# Altium project OneStep.PrjPCB
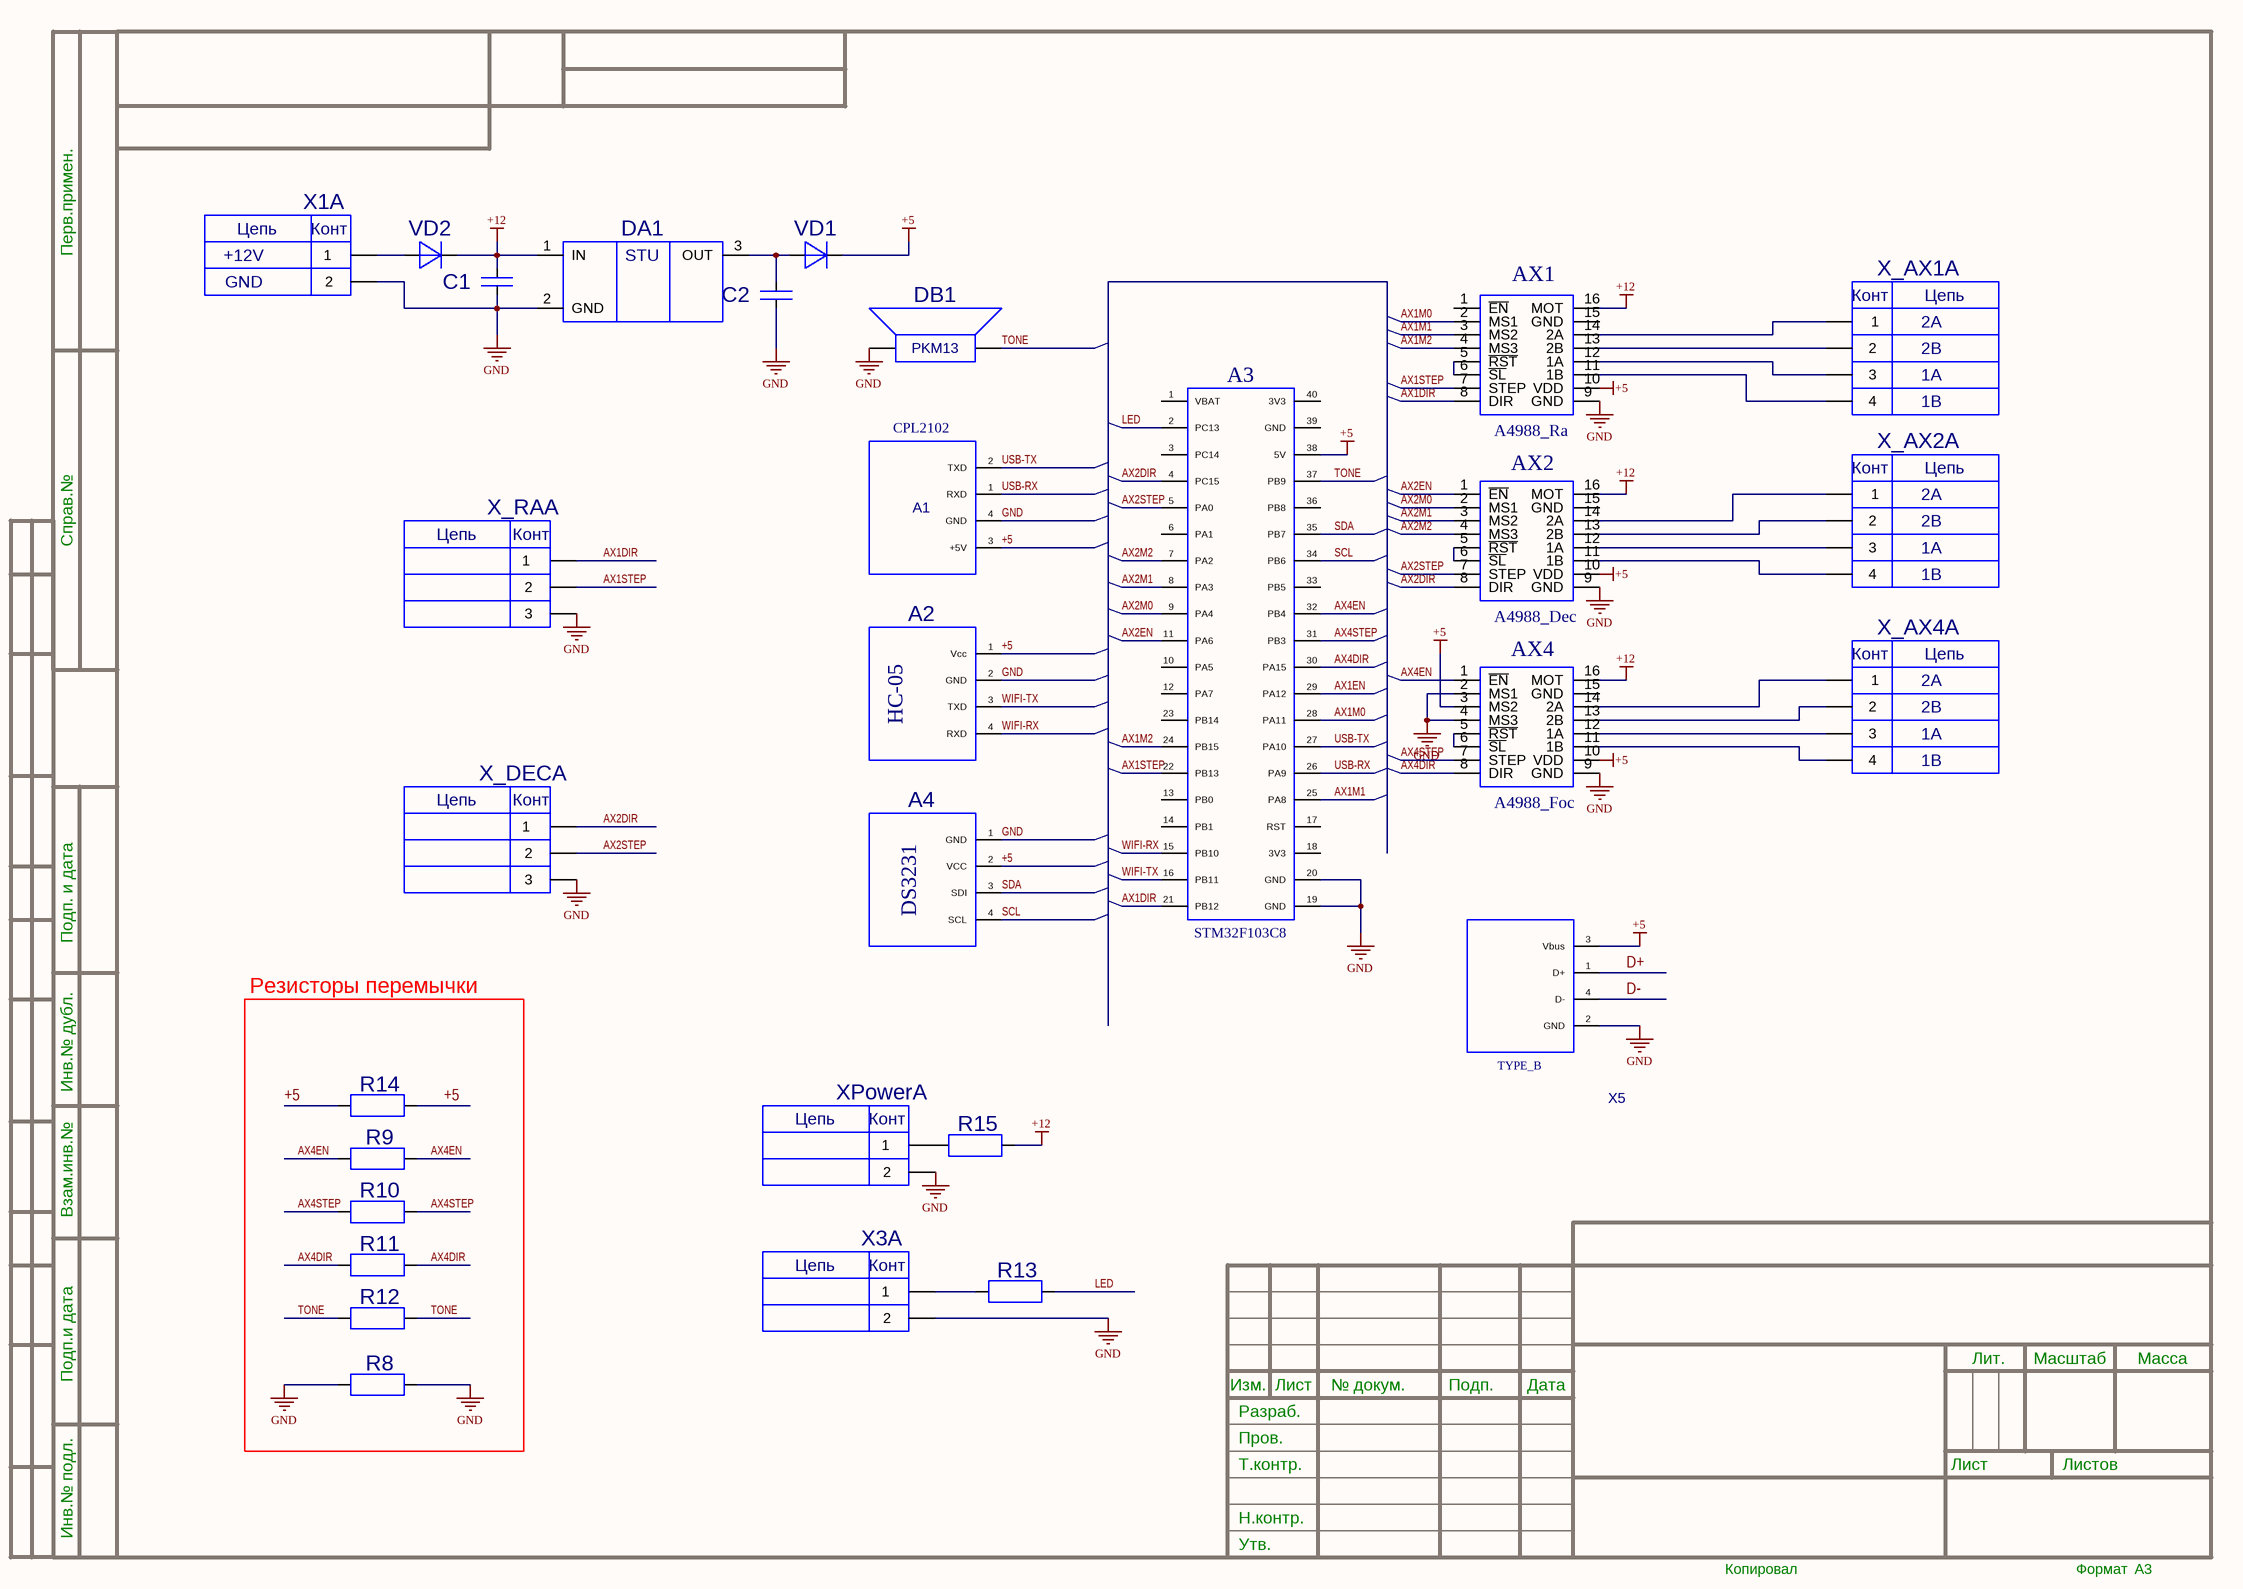
[diagram p0: OneStep.SchDoc]
Âèä_äîêóìåíòà: Ñõåìà ýëåêòðè÷åñêàÿ ïðèíöèïèàëüíàÿ; Êîä_äîêóìåíòà: Ý3; Наименование: 65656564364363635465/46546546546344623634; Обозначение: OneStep v3.16 Blue pill; Ðàçäåë: Äîêóìåíòàöèÿ; Ôèðìà: ÎÎÎ "Горизонт"; ï_Ðàçðàá: Ïåòðîâ
1 sheet, 30 parts. Net scope: global (net labels, ports and power ports of the same name join across sheets).
Board files: OneStep_È1.PcbDoc, OneStep_multy.PcbDoc

## Sheet OneStep.SchDoc
size 420 x 297 mm; Формат_листа: А3

### Parts
A1  CPL2102  [CP2102]
A2  HC-05  [HC-05]
A3  STM32F103C8  [STM32BLUE_PILL]
A4  DS3231  [DS3231]
AX1  A4988_Ra  [A4899]
AX2  A4988_Dec  [A4899]
AX4  A4988_Foc  [A4899]
C1  4,7мкФ  [C1206H19]  (value not drawn)
C2  4,7мкФ  [C1206H19]  (value not drawn)
DA1  L7805CD2T  [D2PAK]  (value not drawn)
DB1  PKM13  [PKM13]
R8  0 Ом  [R1206H07]  (value not drawn)
R9  0 Ом  [R1206H07]  (value not drawn)
R10  0 Ом  [R1206H07]  (value not drawn)
R11  0 Ом  [R1206H07]  (value not drawn)
R12  0 Ом  [R1206H07]  (value not drawn)
R13  0 Ом  [R1206H07]  (value not drawn)
R14  0 Ом  [R1206H07]  (value not drawn)
R15  24кОм  [R1206H07]  (value not drawn)
VD1  US1J  [SMA]  (value not drawn)
VD2  US1J  [SMA]  (value not drawn)
X1  PLS-02  [PLS-02]  (value not drawn)  (part A of 2)
X3  PLS-02  [PLS-02]  (value not drawn)  (part A of 2)
X5  TYPE_B  [Type_B]
X_AX1  PLS-04  [PLS-04]  (value not drawn)  (part A of 4)
X_AX2  PLS-04  [PLS-04]  (value not drawn)  (part A of 4)
X_AX4  PLS-04  [PLS-04]  (value not drawn)  (part A of 4)
X_DEC  DG128-5.0-03P  [DG128-5.0-03]  (value not drawn)  (part A of 3)
X_RA  DG128-5.0-03P  [DG128-5.0-03]  (value not drawn)  (part A of 3)
XPower  PLS-02  [PLS-02]  (value not drawn)  (part A of 2)

### Blocks framed on the sheet
Резисторы перемычки: R8-R12 R14

### Nets
+5: A1.3(+5V) A2.1(Vcc) A3.38(5V) A4.2(VCC) AX1.10(VDD) AX2.10(VDD) AX4.3(MS2) AX4.10(VDD) R14.1 R14.2 VD1.2(-) X5.3(Vbus)
+12: AX1.16(MOT) AX2.16(MOT) AX4.16(MOT) C1.2 DA1.1(IN) R15.2 VD2.2(-)
GND: A1.4(GND) A2.2(GND) A3.19(GND) A3.20(GND) A4.1(GND) AX1.9(GND) AX2.9(GND) AX4.2(MS1) AX4.4(MS3) AX4.9(GND) C1.1 C2.1 DA1.2(GND) DB1.1 R8.1 R8.2 X1.2 X3.2 X5.2(GND) X_DEC.3 X_RA.3 XPower.2
AX1DIR: A3.21(PB12) AX1.8(DIR) X_RA.1
AX1EN: A3.29(PA12)
AX1M0: A3.28(PA11) AX1.2(MS1)
AX1M1: A3.25(PA8) AX1.3(MS2)
AX1M2: A3.24(PB15) AX1.4(MS3)
AX1STEP: A3.22(PB13) AX1.7(STEP) X_RA.2
AX2DIR: A3.4(PC15) AX2.8(DIR) X_DEC.1
AX2EN: A3.11(PA6) AX2.1(~{EN})
AX2M0: A3.9(PA4) AX2.2(MS1)
AX2M1: A3.8(PA3) AX2.3(MS2)
AX2M2: A3.7(PA2) AX2.4(MS3)
AX2STEP: A3.5(PA0) AX2.7(STEP) X_DEC.2
AX4DIR: A3.30(PA15) AX4.8(DIR) R11.1 R11.2
AX4EN: A3.32(PB4) AX4.1(~{EN}) R9.1 R9.2
AX4STEP: A3.31(PB3) AX4.7(STEP) R10.1 R10.2
D+: X5.1(D+)
D-: X5.4(D-)
LED: A3.2(PC13) R13.2
SCL: A3.34(PB6) A4.4(SCL)
SDA: A3.35(PB7) A4.3(SDI)
TONE: A3.37(PB9) DB1.2 R12.1 R12.2
USB-RX: A1.1(RXD) A3.26(PA9)
USB-TX: A1.2(TXD) A3.27(PA10)
WIFI-RX: A2.4(RXD) A3.15(PB10)
WIFI-TX: A2.3(TXD) A3.16(PB11)
NetAX1_5: AX1.5(~{RST}) AX1.6(~{SL})
NetAX1_11: AX1.11(1B) X_AX1.4
NetAX1_12: AX1.12(1A) X_AX1.3
NetAX1_13: AX1.13(2B) X_AX1.2
NetAX1_14: AX1.14(2A) X_AX1.1
NetAX2_5: AX2.5(~{RST}) AX2.6(~{SL})
NetAX2_11: AX2.11(1B) X_AX2.4
NetAX2_12: AX2.12(1A) X_AX2.3
NetAX2_13: AX2.13(2B) X_AX2.2
NetAX2_14: AX2.14(2A) X_AX2.1
NetAX4_5: AX4.5(~{RST}) AX4.6(~{SL})
NetAX4_11: AX4.11(1B) X_AX4.4
NetAX4_12: AX4.12(1A) X_AX4.3
NetAX4_13: AX4.13(2B) X_AX4.2
NetAX4_14: AX4.14(2A) X_AX4.1
NetC2_2: C2.2 DA1.3(OUT) VD1.1(+)
NetR13_1: R13.1 X3.1
NetR15_1: R15.1 XPower.1
NetVD2_1: VD2.1(+) X1.1

Not connected (* = marked no-connect by the designer): A3 1(VBAT) 3(PC14) 6(PA1) 10(PA5) 12(PA7) 13(PB0) 14(PB1) 17(RST) 18(3V3) 23(PB14) 33(PB5) 36(PB8) 39(GND) 40(3V3); AX1 1(~{EN}) 15(GND); AX2 15(GND); AX4 15(GND)

### Notes on the sheet
- +12V
- GND
- 2A
- 2B
- 1A
- 1B
- Перв.примен.
- Справ.№
- Подп. и дата
- Инв.№ дубл.
- Взам.инв.№
- Подп.и дата
- Разраб.
- Изм.
- Лист
- № докум.
- Подп.
- Дата
- Лит.
- Масштаб
- Масса
- Т.контр.
- Пров.
- Листов
- Инв.№ подл.
- Утв.
- Н.контр.
- Копировал
- Формат
- (in symbol DG128-5.0-03P-14, part A) Цепь; Конт
- (in symbol PLS-02, part A) Цепь; Конт
- (in symbol PLS-04, part A) Конт; Цепь

### Library data of the parts
A1 = CPL2102: Manufacturer: Texas Instruments; ValueBOM: Микросхема CPL2102 Texas Instruments; DType: Микросхема; ComponentLink1Description: Datasheet; ComponentLink1URL: c:\Dataseets\Микросхемы\По фирмам\Avago Technologies\HCPL-4100.pdf; Package: SOT23-6; ValueSch: CPL2102
A2 = HC-05: Manufacturer: Texas Instruments; ValueBOM: Микросхема HC-05 Texas Instruments; DType: Микросхема; ComponentLink1Description: Datasheet; ComponentLink1URL: c:\Dataseets\Микросхемы\По фирмам\Avago Technologies\HCPL-4100.pdf; Package: SOT23-6; ValueSch: HC-05
A3 = STM32BLUE_PILL: Manufacturer: NXP; DType: Микросхема; ValueBOM: Микросхема STM32F103C8 NXP; ValueSch: STM32F103C8; ComponentLink1Description: Datasheet; ComponentLink1URL: c:\Dataseets\Микросхемы\По фирмам\Avago Technologies\HCPL-4100.pdf; Package: TSSOP8
A4 = DS3231: Manufacturer: Texas Instruments; ValueBOM: Микросхема DS3231 Texas Instruments; DType: Микросхема; ComponentLink1Description: Datasheet; ComponentLink1URL: c:\Dataseets\Микросхемы\По фирмам\Avago Technologies\HCPL-4100.pdf; Package: SOT23-6; ValueSch: DS3231
AX1 AX2 AX4 = DRV8825: STEP Motor Driver; TemperatureOperating: -40°C to +85°C; Поставщик: Texas; FullName: Микросхема MAX1316ECM Maxim; ID: DRV8825; ComponentLink1Description: Ссылка на сайт производителя; ComponentLink2Description: Ссылка на сайт производителя; ComponentLink3Description: Ссылка на сайт производителя; HelpURL: D:\Local_view\PDM\Справочники\Перечень ЭРИ\Документация\max1316-max1326.pdf; Mounting: SMT; PackageType: PLS; Part Number: DRV8825; TemperatureStorage: -40°C to +85°C; Type: Микросхема
C1 C2 = C1206 X7R 50V 4.7uF: Керамический ЧИП конденсатор; Part Number: 1206 X7R 50В 4,7мкФ; TemperatureOperating_max: 125; TemperatureOperating_min: -55; TKE: X7R; Tolerance: ±10%; Value: 4.7uF; Voltage: 50V; FullName: Конденсатор 1206 X7R 50В 4,7мкФ; ID: C1206 X7R 50V 4.7uF; ComponentLink1Description: Ссылка на сайт производителя; ComponentLink2Description: Ссылка на сайт производителя; ComponentLink3Description: Ссылка на сайт производителя; HelpURL: D:\local_view\PDM\Справочники\Перечень ЭРИ\Документация\Конденсаторы\Керамические\ЧИП\0201-1812_TY.pdf; Mounting: SMT; Package: 1206; PackageType: CAP-CHIP; Type: Конденсатор
DA1 = L7805CD2T: Positive voltage regulator; Manufacturer: ST Microelectronics; ExtendedParameters: DC Input voltage 35V / Output voltage 5+-2V / Output current to 1.5A / Dropout voltage 2-2.5V / Output noise voltage 40 µV/VO; Functionality: Линейные стабилизаторы напряжения; TemperatureOperating_max: +150; TemperatureOperating_min: -65; FullName: Микросхема L7805CD2T ST Microelectronics; ID: L7805CD2T; ComponentLink1Description: Ссылка на сайт производителя; ComponentLink2Description: Ссылка на сайт производителя; ComponentLink3Description: Ссылка на сайт производителя; HelpURL: D:\local_view\PDM\Справочники\Перечень ЭРИ\Документация\Микросхемы\Линейные стабилизаторы напряжения\L7800_STMicroelectronics.pdf; Mounting: SMT; Package: D2PAK; PackageType: DPAK; Part Number: L7805CD2T; Type: Микросхема
DB1 = PKM13: =Description
R8-R14 = R1206 0Ohm_5: Постоянный ЧИП резистор; Part Number: 1206 0 Ом±5%; Power: 0.25W; TemperatureOperating_max: 155; TemperatureOperating_min: -55; Tolerance: ±5%; Value: 0Оhm; FullName: Резистор 1206 0 Ом±5%; ID: R1206 0Ohm_5; ComponentLink1Description: Ссылка на сайт производителя; ComponentLink2Description: Ссылка на сайт производителя; ComponentLink3Description: Ссылка на сайт производителя; HelpURL: D:\Local_view\PDM\Справочники\Перечень ЭРИ\Документация\Резисторы\Постоянные\ЧИП\RC1206_yageo.pdf; Mounting: SMT; Package: 1206; PackageType: RES-CHIP; Type: Резистор
R15 = R1206 24kOhm_5: Постоянный ЧИП резистор; Part Number: 1206 24кОм±5%; Power: 0.25W; TemperatureOperating_max: 155; TemperatureOperating_min: -55; Tolerance: ±5%; Value: 24кОhm; FullName: Резистор 1206 24кОм±5%; ID: R1206 24kOhm_5; ComponentLink1Description: Ссылка на сайт производителя; ComponentLink2Description: Ссылка на сайт производителя; ComponentLink3Description: Ссылка на сайт производителя; HelpURL: D:\Local_view\PDM\Справочники\Перечень ЭРИ\Документация\Резисторы\Постоянные\ЧИП\RC1206_yageo.pdf; Mounting: SMT; Package: 1206; PackageType: RES-CHIP; Type: Резистор
VD1 VD2 = US1J: Surface Mount Ultra Fast Rectifier; Manufacturer: Vishay; Current: 1A; Reverse_Voltage: 420V; TemperatureOperating_max: 150; TemperatureOperating_min: -55; Type: Диод; FullName: Диод US1J Vishay; ID: US1J; ComponentLink1Description: Ссылка на сайт производителя; ComponentLink2Description: Ссылка на сайт производителя; ComponentLink3Description: Ссылка на сайт производителя; HelpURL: D:\local_view\PDM\Справочники\Перечень ЭРИ\Документация\Диоды\Выпрямительные и импульсные диоды\US1A-US1M_Vishay.pdf; Mounting: SMT; Package: SMA; PackageType: SMA; Part Number: US1J
X1 X3 XPower = PLS-02: Вилка на плату прямая шаг 2,54 мм 1 ряд; Current: 1А; TemperatureOperating_max: 105; TemperatureOperating_min: -25; Voltage_max: 250V; FullName: Вилка PLS-02; ID: PLS-02; ComponentLink1Description: Ссылка на сайт производителя; ComponentLink2Description: Ссылка на сайт производителя; ComponentLink3Description: Ссылка на сайт производителя; HelpURL: D:\Local_view\PDM\Справочники\Перечень ЭРИ\Документация\Соединители\Прямоугольные\pld_pls.pdf; Mounting: THT; Package: PLS-02; PackageType: CON-PLD; Part Number: PLS-02; Type: Вилка
X5 = USB_type_B: Manufacturer: Texas Instruments; ValueBOM: Микросхема TYPE_B Texas Instruments; DType: Микросхема; ComponentLink1Description: Datasheet; ComponentLink1URL: c:\Dataseets\Микросхемы\По фирмам\Avago Technologies\HCPL-4100.pdf; Package: SOT23-6; ValueSch: TYPE_B
X_AX1 X_AX2 X_AX4 = PLS-04: Вилка на плату прямая шаг 2,54 мм 1 ряд; Current: 1А; TemperatureOperating_max: 105; TemperatureOperating_min: -25; Voltage_max: 250V; FullName: Вилка PLS-04; ID: PLS-04; ComponentLink1Description: Ссылка на сайт производителя; ComponentLink2Description: Ссылка на сайт производителя; ComponentLink3Description: Ссылка на сайт производителя; HelpURL: D:\Local_view\PDM\Справочники\Перечень ЭРИ\Документация\Соединители\Прямоугольные\pld_pls.pdf; Mounting: THT; Package: PLS-04; PackageType: CON-PLD; Part Number: PLS-04; Type: Вилка
X_DEC X_RA = DG128-5.0-03P-14: Винтовой клеммник, / 3 контакта; Manufacturer: DEGSON; ExtendedParameters: Сечение 24-12AWG/2.5 кв.мм / 300V, 10А; TemperatureOperating_max: 105; TemperatureOperating_min: -40; FullName: Клеммник DG128-5.0-03P-14 Degson; ID: DG128-5.0-03P-14; ComponentLink1Description: Ссылка на сайт производителя; ComponentLink2Description: Ссылка на сайт производителя; ComponentLink3Description: Ссылка на сайт производителя; HelpURL: D:\Local_view\PDM\Справочники\Перечень ЭРИ\Документация\Соединители\Клеммники\DG128-5.0.pdf; Mounting: THT; Package: DG128-03; PackageType: DG128; Part Number: DG128-5.0-03P-14; Type: Клеммник